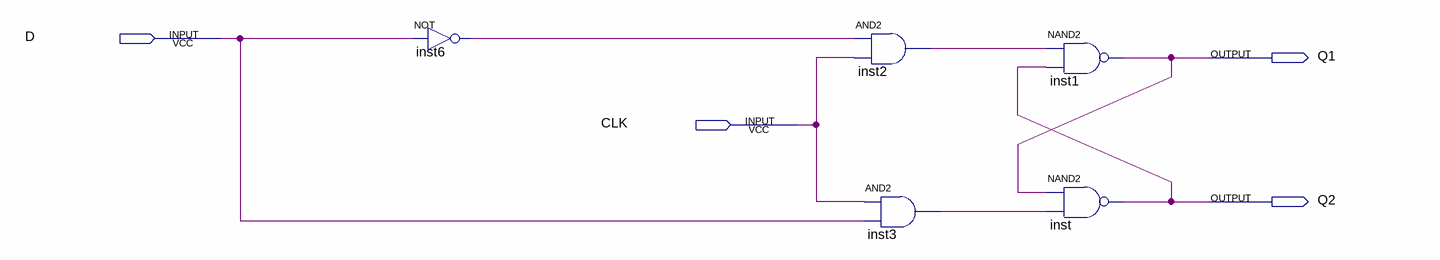
[diagram p0: schematic sheet]
// Quartus schematic flipflop_D.bdf as structural Verilog: 5 symbols, 4 pins
module flipflop_D (
  input  D,
  input  CLK,
  output Q1,
  output Q2
);

  wire inst2_out, inst3_out, inst6_out;

  not inst6 (inst6_out, D);
  and inst2 (inst2_out, inst6_out, CLK);
  and inst3 (inst3_out, CLK, D);
  nand inst1 (Q1, inst2_out, Q2);
  nand inst (Q2, Q1, inst3_out);
endmodule
